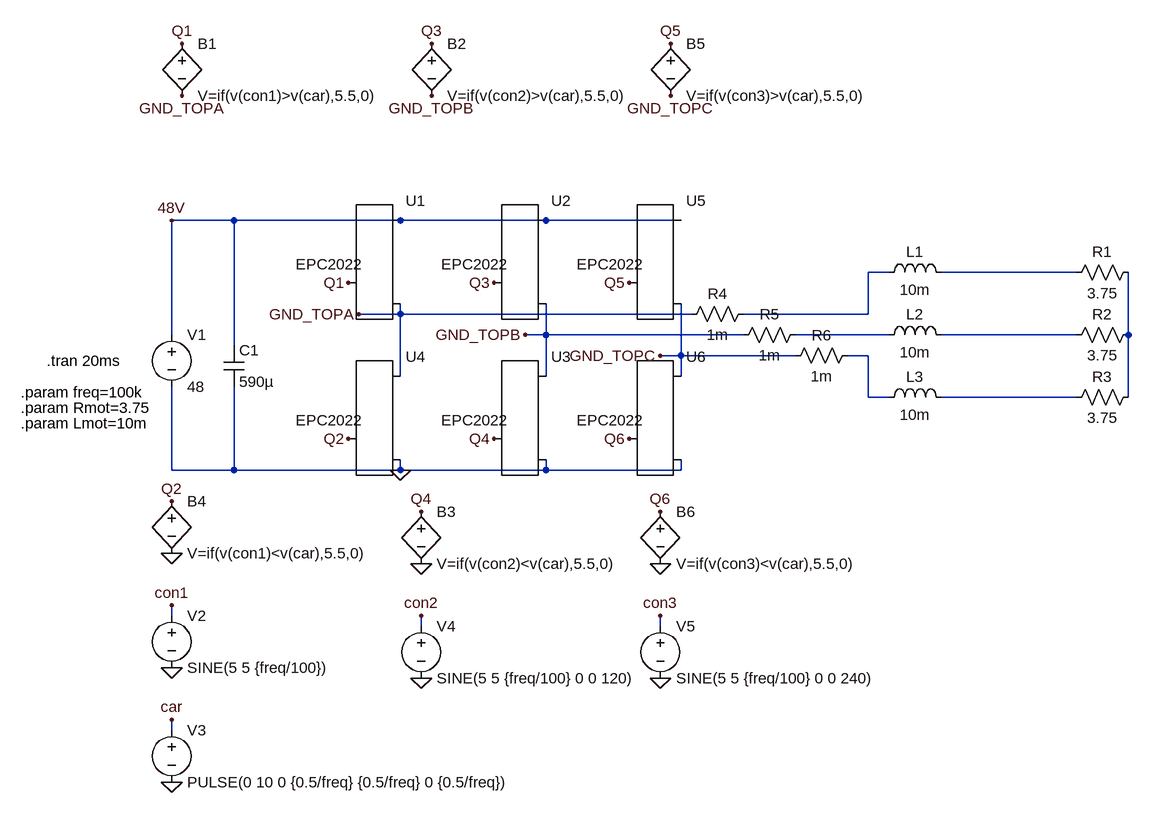
[diagram p0: schematic Threephase.asc]
Threephase.asc, the LTspice schematic file:
Version 4
SHEET 1 2244 740
WIRE -864 -192 -960 -192
WIRE -608 -192 -864 -192
WIRE -384 -192 -608 -192
WIRE -176 -192 -384 -192
WIRE 144 -112 112 -112
WIRE 432 -112 224 -112
WIRE -608 -48 -608 -64
WIRE -608 -48 -672 -48
WIRE -160 -48 -608 -48
WIRE 112 -48 112 -112
WIRE 112 -48 -80 -48
WIRE -960 -16 -960 -192
WIRE -384 -16 -384 -64
WIRE -384 -16 -416 -16
WIRE -80 -16 -384 -16
WIRE 144 -16 0 -16
WIRE 432 -16 224 -16
WIRE 512 -16 512 -112
WIRE -864 0 -864 -192
WIRE -176 16 -176 -64
WIRE -176 16 -208 16
WIRE 0 16 -176 16
WIRE 112 16 80 16
WIRE -608 48 -608 -48
WIRE -384 48 -384 -16
WIRE -176 48 -176 16
WIRE 112 80 112 16
WIRE 144 80 112 80
WIRE 432 80 224 80
WIRE 512 80 512 -16
WIRE -960 192 -960 64
WIRE -864 192 -864 64
WIRE -864 192 -960 192
WIRE -608 192 -608 176
WIRE -608 192 -864 192
WIRE -384 192 -384 176
WIRE -384 192 -608 192
WIRE -176 192 -176 176
WIRE -176 192 -384 192
WIRE -960 416 -960 400
WIRE -576 432 -576 416
WIRE -208 432 -208 416
WIRE -960 592 -960 576
FLAG -944 -464 Q1
FLAG -608 192 0
FLAG -960 400 con1
FLAG -960 576 car
FLAG -960 496 0
FLAG -960 672 0
FLAG -560 -464 Q3
FLAG -576 336 0
FLAG -576 256 Q4
FLAG -960 320 0
FLAG -960 240 Q2
FLAG -688 -96 Q1
FLAG -464 -96 Q3
FLAG -688 144 Q2
FLAG -464 144 Q4
FLAG -672 -48 GND_TOPA
FLAG -960 -192 48V
FLAG -560 -384 GND_TOPB
FLAG -944 -384 GND_TOPA
FLAG -576 416 con2
FLAG -576 512 0
FLAG -416 -16 GND_TOPB
FLAG -256 -96 Q5
FLAG -256 144 Q6
FLAG -208 16 GND_TOPC
FLAG -208 416 con3
FLAG -208 336 0
FLAG -208 256 Q6
FLAG -208 512 0
FLAG -192 -384 GND_TOPC
FLAG -192 -464 Q5
SYMBOL bv -944 -480 R0
SYMATTR InstName B1
SYMATTR Value V=if(v(con1)>v(car),5.5,0)
SYMBOL bv -560 -480 R0
SYMATTR InstName B2
SYMATTR Value V=if(v(con2)>v(car),5.5,0)
SYMBOL cap -880 0 R0
SYMATTR InstName C1
SYMATTR Value 590µ
SYMBOL voltage -960 -32 R0
WINDOW 123 0 0 Left 0
WINDOW 39 0 0 Left 0
SYMATTR InstName V1
SYMATTR Value 48
SYMBOL voltage -960 400 R0
WINDOW 123 0 0 Left 0
WINDOW 39 0 0 Left 0
SYMATTR InstName V2
SYMATTR Value SINE(5 5 {freq/100})
SYMBOL voltage -960 576 R0
WINDOW 123 0 0 Left 0
WINDOW 39 0 0 Left 0
SYMATTR InstName V3
SYMATTR Value PULSE(0 10 0 {0.5/freq} {0.5/freq} 0 {0.5/freq})
SYMBOL bv -576 240 R0
SYMATTR InstName B3
SYMATTR Value V=if(v(con2)<v(car),5.5,0)
SYMBOL bv -960 224 R0
SYMATTR InstName B4
SYMATTR Value V=if(v(con1)<v(car),5.5,0)
SYMBOL EPCGaN -464 144 R0
WINDOW 3 -81 -29 Left 2
SYMATTR Value EPC2022
SYMATTR InstName U3
SYMBOL EPCGaN -688 144 R0
WINDOW 3 -81 -29 Left 2
SYMATTR Value EPC2022
SYMATTR InstName U4
SYMBOL voltage -576 416 R0
WINDOW 123 0 0 Left 0
WINDOW 39 0 0 Left 0
SYMATTR InstName V4
SYMATTR Value SINE(5 5 {freq/100} 0 0 120)
SYMBOL EPCGaN -256 144 R0
WINDOW 3 -81 -29 Left 2
SYMATTR Value EPC2022
SYMATTR InstName U6
SYMBOL EPCGaN -688 -96 R0
WINDOW 3 -81 -29 Left 2
SYMATTR Value EPC2022
SYMATTR InstName U1
SYMBOL EPCGaN -464 -96 R0
WINDOW 3 -81 -29 Left 2
SYMATTR Value EPC2022
SYMATTR InstName U2
SYMBOL EPCGaN -256 -96 R0
WINDOW 3 -81 -29 Left 2
SYMATTR Value EPC2022
SYMATTR InstName U5
SYMBOL bv -192 -480 R0
SYMATTR InstName B5
SYMATTR Value V=if(v(con3)>v(car),5.5,0)
SYMBOL voltage -208 416 R0
WINDOW 123 0 0 Left 0
WINDOW 39 0 0 Left 0
SYMATTR InstName V5
SYMATTR Value SINE(5 5 {freq/100} 0 0 240)
SYMBOL bv -208 240 R0
SYMATTR InstName B6
SYMATTR Value V=if(v(con3)<v(car),5.5,0)
SYMBOL ind 240 -96 M270
WINDOW 0 32 56 VTop 2
WINDOW 3 5 56 VBottom 2
SYMATTR InstName L1
SYMATTR Value 10m
SYMBOL ind 240 0 M270
WINDOW 0 32 56 VTop 2
WINDOW 3 5 56 VBottom 2
SYMATTR InstName L2
SYMATTR Value 10m
SYMBOL ind 240 96 M270
WINDOW 0 32 56 VTop 2
WINDOW 3 5 56 VBottom 2
SYMATTR InstName L3
SYMATTR Value 10m
SYMBOL res 416 -96 R270
WINDOW 0 32 56 VTop 2
WINDOW 3 0 56 VBottom 2
SYMATTR InstName R1
SYMATTR Value 3.75
SYMBOL res 416 0 R270
WINDOW 0 32 56 VTop 2
WINDOW 3 0 56 VBottom 2
SYMATTR InstName R2
SYMATTR Value 3.75
SYMBOL res 416 96 R270
WINDOW 0 32 56 VTop 2
WINDOW 3 0 56 VBottom 2
SYMATTR InstName R3
SYMATTR Value 3.75
SYMBOL res -64 -64 R90
WINDOW 0 0 56 VBottom 2
WINDOW 3 32 56 VTop 2
SYMATTR InstName R4
SYMATTR Value 1m
SYMBOL res 16 -32 R90
WINDOW 0 0 56 VBottom 2
WINDOW 3 32 56 VTop 2
SYMATTR InstName R5
SYMATTR Value 1m
SYMBOL res 96 0 R90
WINDOW 0 0 56 VBottom 2
WINDOW 3 32 56 VTop 2
SYMATTR InstName R6
SYMATTR Value 1m
TEXT -1152 24 Left 2 !.tran 20ms
TEXT -1192 72 Left 2 !.param freq=100k
TEXT -1192 96 Left 2 !.param Rmot=3.75
TEXT -1192 120 Left 2 !.param Lmot=10m

The netlist it stands for:
* Threephase.asc
B1 Q1 GND_TOPA V=if(v(con1)>v(car),5.5,0)
B2 Q3 GND_TOPB V=if(v(con2)>v(car),5.5,0)
C1 48V 0 590µ
V1 48V 0 48
V2 con1 0 SINE(5 5 {freq/100})
V3 car 0 PULSE(0 10 0 {0.5/freq} {0.5/freq} 0 {0.5/freq})
B3 Q4 0 V=if(v(con2)<v(car),5.5,0)
B4 Q2 0 V=if(v(con1)<v(car),5.5,0)
XU3 Q4 GND_TOPB 0 EPC2022
XU4 Q2 GND_TOPA 0 EPC2022
V4 con2 0 SINE(5 5 {freq/100} 0 0 120)
XU6 Q6 GND_TOPC 0 EPC2022
XU1 Q1 48V GND_TOPA EPC2022
XU2 Q3 48V GND_TOPB EPC2022
XU5 Q5 48V GND_TOPC EPC2022
B5 Q5 GND_TOPC V=if(v(con3)>v(car),5.5,0)
V5 con3 0 SINE(5 5 {freq/100} 0 0 240)
B6 Q6 0 V=if(v(con3)<v(car),5.5,0)
L1 N002 N001 10m
L2 N004 N003 10m
L3 N007 N006 10m
R1 N002 N005 3.75
R2 N004 N005 3.75
R3 N007 N005 3.75
R4 N001 GND_TOPA 1m
R5 N003 GND_TOPB 1m
R6 N006 GND_TOPC 1m
.tran 20ms
.param freq=100k
.param Rmot=3.75
.param Lmot=10m
.backanno
.end